# Altium project PCB_3U_Kasli.PrjPCB (part 5 of 7)

## Sheet FPGA_I2C.SchDoc: =ProjectName
size 420 x 297 mm; Author: G.K.; CompanyName: WUT; DrawnBy: P.K.; Organization: WUT ISE; Address1: Warsaw Univeristy of Technology; Address2: Nowowiejska 15/19; DocumentNumber: 11; Revision: 1.1; SheetNumber: 11; SheetTotal: 12; EDA_Number: ARTIQ; Projet: ARTIQ/SINARA; ModifiedBy: -; CreateDate: XX/XX/XXXX; CheckedDate: -; Title2: FPGA_I2C.SchDoc; DivGrp: ISE; Designer: P.K.; ModifiedDate: -; ProjectName: ARTIQ/SINARA
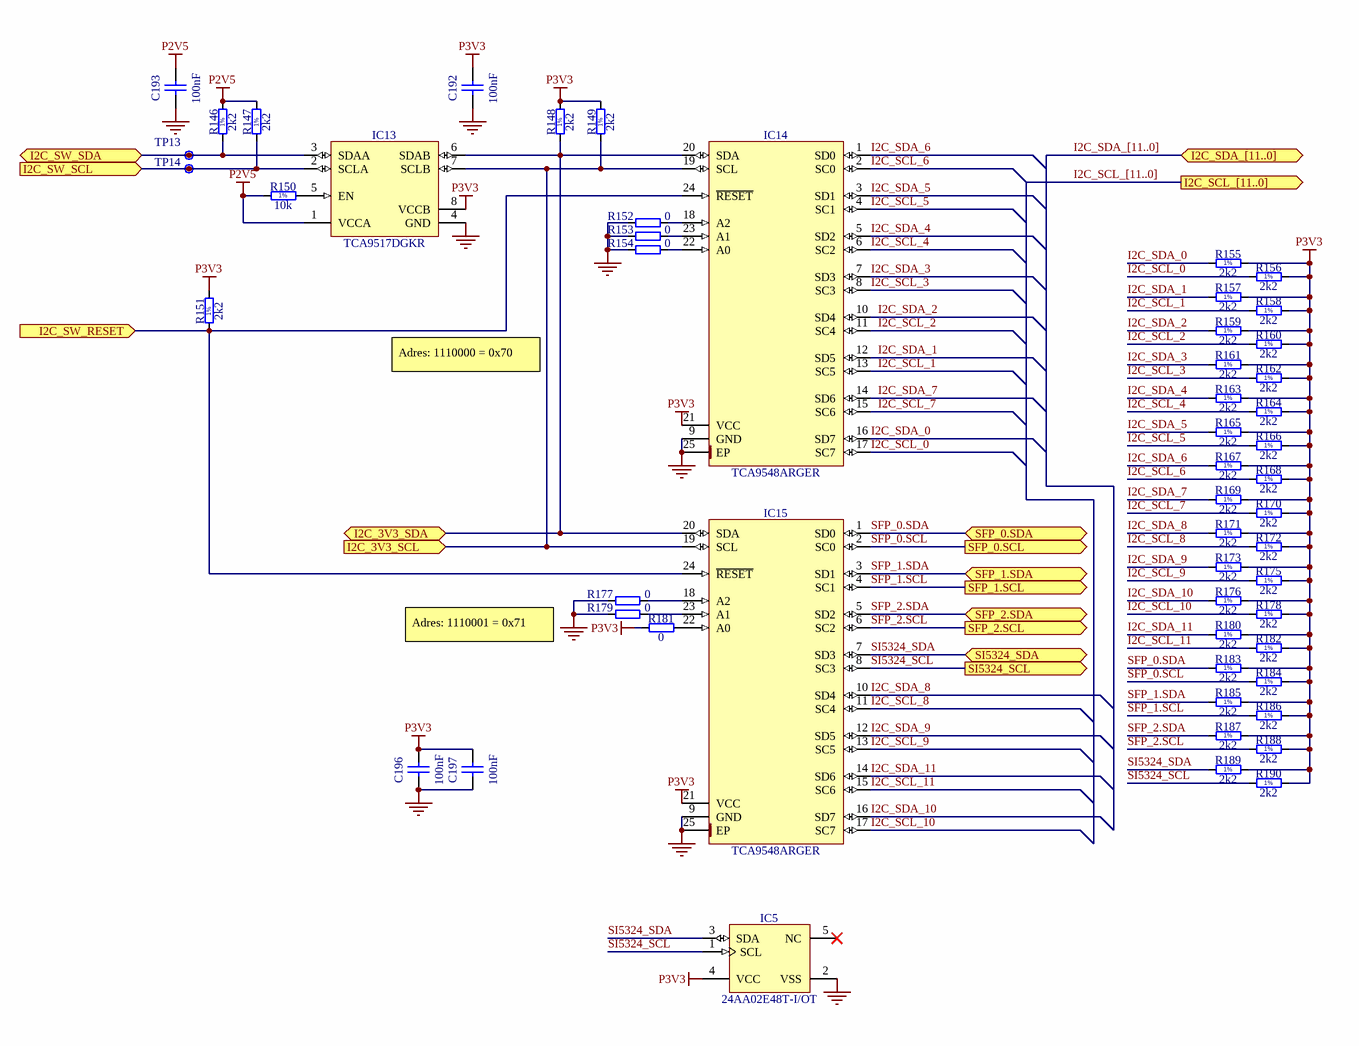
[diagram p8: FPGA_I2C.SchDoc]

### Parts
C192  100nF  [CAPC0603X33N]
C193  100nF  [CAPC0603X33N]
C196  100nF  [CAPC0603X33N]
C197  100nF  [CAPC0603X33N]
IC5  24AA02E48T-I/OT  [SOT95P280X145-5N]
IC13  TCA9517DGKR  [SOP65P490X110-8N]
IC14  TCA9548ARGER  [QFN50P400X400X100-25N-S220]
IC15  TCA9548ARGER  [QFN50P400X400X100-25N-S220]
R146  2k2  [RESC1005X40N]
R147  2k2  [RESC1005X40N]
R148  2k2  [RESC1005X40N]
R149  2k2  [RESC1005X40N]
R150  10k  [RESC1005X40N]
R151  2k2  [RESC1005X40N]
R152  0  [RESC1005X40N]
R153  0  [RESC1005X40N]
R154  0  [RESC1005X40N]
R155  2k2  [RESC1005X40N]
R156  2k2  [RESC1005X40N]
R157  2k2  [RESC1005X40N]
R158  2k2  [RESC1005X40N]
R159  2k2  [RESC1005X40N]
R160  2k2  [RESC1005X40N]
R161  2k2  [RESC1005X40N]
R162  2k2  [RESC1005X40N]
R163  2k2  [RESC1005X40N]
R164  2k2  [RESC1005X40N]
R165  2k2  [RESC1005X40N]
R166  2k2  [RESC1005X40N]
R167  2k2  [RESC1005X40N]
R168  2k2  [RESC1005X40N]
R169  2k2  [RESC1005X40N]
R170  2k2  [RESC1005X40N]
R171  2k2  [RESC1005X40N]
R172  2k2  [RESC1005X40N]
R173  2k2  [RESC1005X40N]
R175  2k2  [RESC1005X40N]
R176  2k2  [RESC1005X40N]
R177  0  [RESC1005X40N]
R178  2k2  [RESC1005X40N]
R179  0  [RESC1005X40N]
R180  2k2  [RESC1005X40N]
R181  0  [RESC1005X40N]
R182  2k2  [RESC1005X40N]
R183  2k2  [RESC1005X40N]
R184  2k2  [RESC1005X40N]
R185  2k2  [RESC1005X40N]
R186  2k2  [RESC1005X40N]
R187  2k2  [RESC1005X40N]
R188  2k2  [RESC1005X40N]
R189  2k2  [RESC1005X40N]
R190  2k2  [RESC1005X40N]
TP13  I2C SW SDA  [TPS127]  (value not drawn)
TP14  I2C SW SCL  [TPS127]  (value not drawn)

### Ports
I2C_3V3_SCL (in), I2C_3V3_SDA (bidir), I2C_SCL_[11..0] (out), I2C_SDA_[11..0] (bidir), I2C_SW_RESET (in), I2C_SW_SCL (in), I2C_SW_SDA (bidir), SFP_0.SCL (out), SFP_0.SDA (bidir), SFP_1.SCL (out), SFP_1.SDA (bidir), SFP_2.SCL (out), SFP_2.SDA (bidir), SI5324_SCL (out), SI5324_SDA (bidir)

### Nets
GND: C192.1 C193.1 C196.1 C197.1 IC5.2(VSS) IC13.4(GND) IC14.9(GND) IC14.25(EP) IC15.9(GND) IC15.25(EP) R152.1 R153.1 R154.1 R177.1 R179.1
P2V5: C193.2 IC13.1(VCCA) R146.2 R147.2 R150.1
P3V3: C192.2 C196.2 C197.2 IC5.4(VCC) IC13.8(VCCB) IC14.21(VCC) IC15.21(VCC) R148.2 R149.2 R151.2 R155.2 R156.2 R157.2 R158.2 R159.2 R160.2 R161.2 R162.2 R163.2 R164.2 R165.2 R166.2 R167.2 R168.2 R169.2 R170.2 R171.2 R172.2 R173.2 R175.2 R176.2 R178.2 R180.2 R181.1 R182.2 R183.2 R184.2 R185.2 R186.2 R187.2 R188.2 R189.2 R190.2
I2C_3V3_SCL: IC13.7(SCLB) IC14.19(SCL) IC15.19(SCL) R149.1 ; port I2C_3V3_SCL
I2C_3V3_SDA: IC13.6(SDAB) IC14.20(SDA) IC15.20(SDA) R148.1 ; port I2C_3V3_SDA
I2C_SCL_0: IC14.17(SC7) R156.1
I2C_SCL_1: IC14.13(SC5) R158.1
I2C_SCL_2: IC14.11(SC4) R160.1
I2C_SCL_3: IC14.8(SC3) R162.1
I2C_SCL_4: IC14.6(SC2) R164.1
I2C_SCL_5: IC14.4(SC1) R166.1
I2C_SCL_6: IC14.2(SC0) R168.1
I2C_SCL_7: IC14.15(SC6) R170.1
I2C_SCL_8: IC15.11(SC4) R172.1
I2C_SCL_9: IC15.13(SC5) R175.1
I2C_SCL_10: IC15.17(SC7) R178.1
I2C_SCL_11: IC15.15(SC6) R182.1
I2C_SDA_0: IC14.16(SD7) R155.1
I2C_SDA_1: IC14.12(SD5) R157.1
I2C_SDA_2: IC14.10(SD4) R159.1
I2C_SDA_3: IC14.7(SD3) R161.1
I2C_SDA_4: IC14.5(SD2) R163.1
I2C_SDA_5: IC14.3(SD1) R165.1
I2C_SDA_6: IC14.1(SD0) R167.1
I2C_SDA_7: IC14.14(SD6) R169.1
I2C_SDA_8: IC15.10(SD4) R171.1
I2C_SDA_9: IC15.12(SD5) R173.1
I2C_SDA_10: IC15.16(SD7) R176.1
I2C_SDA_11: IC15.14(SD6) R180.1
I2C_SW_RESET: IC14.24(~{RESET}) IC15.24(~{RESET}) R151.1 ; port I2C_SW_RESET
I2C_SW_SCL: IC13.2(SCLA) R147.1 TP14.1 ; port I2C_SW_SCL
I2C_SW_SDA: IC13.3(SDAA) R146.1 TP13.1 ; port I2C_SW_SDA
SFP_0.SCL: IC15.2(SC0) R184.1 ; port SFP_0.SCL
SFP_0.SDA: IC15.1(SD0) R183.1 ; port SFP_0.SDA
SFP_1.SCL: IC15.4(SC1) R186.1 ; port SFP_1.SCL
SFP_1.SDA: IC15.3(SD1) R185.1 ; port SFP_1.SDA
SFP_2.SCL: IC15.6(SC2) R188.1 ; port SFP_2.SCL
SFP_2.SDA: IC15.5(SD2) R187.1 ; port SFP_2.SDA
Si5324_SCL: IC5.1(SCL) IC15.8(SC3) R190.1 ; port SI5324_SCL
Si5324_SDA: IC5.3(SDA) IC15.7(SD3) R189.1 ; port SI5324_SDA
NetIC13_5: IC13.5(EN) R150.2
NetIC14_18: IC14.18(A2) R152.2
NetIC14_22: IC14.22(A0) R154.2
NetIC14_23: IC14.23(A1) R153.2
NetIC15_18: IC15.18(A2) R177.2
NetIC15_22: IC15.22(A0) R181.2
NetIC15_23: IC15.23(A1) R179.2

Not connected (* = marked no-connect by the designer): IC5 5(NC)*

### Buses and harness runs
bus I2C_SCL_[11..0] = port I2C_SCL_[11..0]
bus I2C_SDA_[11..0] = port I2C_SDA_[11..0]

### Notes on the sheet
- Adres: 1110000 = 0x70
- Adres: 1110001 = 0x71
- Project/Equipment
- Document
- Designer
- Drawn by
- Check.by
- File
- Last Mod.
- Print Date
- Sheet
- Size
- A3
- of
- Rev
- (in symbol R0402_2K2_1%_0.0625W_100PPM) 1%
- (in symbol R0402_10K_1%_0.0625W_100PPM) 1%

### Library data of the parts
C192 C193 C196 C197 = CC0201_100NF_6.3V_10%_X5R: as C134 on sheet PowerSupplies; Part Number: CC0201_100NF_6.3V_10%_X5R; Component Kind: Standard; Component Type: Standard; Pin Count: 2; Value: 100nF; Status: Not Recommended; Manufacturer Part Number: CC0201_100NF_6.3V_10%_X5R; Case: 0201; Mounted: Yes; Socket: No; SMD: Yes; Sense: No; Manufacturer1 Example: AVX; Manufacturer1 ComponentHeight: 0.33mm; HelpURL: \\cern.ch\dfs\Applications\Altium\Datasheets\CC0201_X5R_AVX.pdf; Author: CERN DEM JLC; CreateDate: 2007-12-03; LatestRevisionDate: 2007-12-03
IC5 = 24AA02E48T-I/OT: 1.7V-5.5V, 2K I2C Serial EEPROM With EUI-48 Node Identity; Manufacturer: MICROCHIP TECHNOLOGY; PressFit: No; Bonding: No; Part Number: 24AA02E48T-I/OT; Component Kind: Standard; Component Type: Standard; Device: 24AA02E48T-I/OT; PackageDescription: SOT, 0.95mm pitch; 5 pin, 1.60mm W X 2.90mm L X 1.45mm H body, IPC Medium Density; Part Description: 1.7V-5.5V, 2K I2C Serial EEPROM With EUI-48 Node Identity; Manufacturer Part Number: 24AA02E48T-I/OT; Pin Count: 5; Case: SOT23-5; Mounted: Yes; Socket: No; SMD: Yes; Sense: No; ComponentHeight: 1.45mm; HelpURL: \\cern.ch\dfs\Applications\Altium\Datasheets\24AA02E48T-I-OT.pdf; Author: CERN DEM MR; CreateDate: 2016-03-31; LatestRevisionDate: 2016-03-31
IC13 = TCA9517DGKR: Level-Translating I2C Bus Repeater; Manufacturer: TEXAS INSTRUMENTS; PressFit: No; Bonding: No; Part Number: TCA9517DGKR; Component Kind: Standard; Component Type: Standard; Device: TCA9517DGKR; PackageDescription: SOP, 0.65mm, Pitch; 8 Pin, 3.0mm W X 3.0mm L X 1.10mm H Body, IPC Medium Density; Part Description: Level-Translating I2C Bus Repeater; Manufacturer Part Number: TCA9517DGKR; Pin Count: 8; Case: TSSOP8; Mounted: Yes; Socket: No; SMD: Yes; Sense: No; ComponentHeight: 1.1mm; Author: CERN DEM JLC; HelpURL: \\cern.ch\dfs\Applications\Altium\Datasheets\TCA9517DGKR.pdf; CreateDate: 07.07.2014; LatestRevisionDate: 07.07.2014
IC14 IC15 = TCA9548ARGER: Low Voltage 8-Channel I2C Switch With Reset; Manufacturer: TEXAS INSTRUMENTS; PressFit: No; Bonding: No; Part Number: TCA9548ARGER; Component Kind: Standard; Component Type: Standard; Device: TCA9548ARGER; PackageDescription: QFN, 0.50mm Pitch, Square; 24 Pin, 4.00mm L X 4.00mm W X 1.00mm H body (w/thermal tab 2.2 X 2.2mm), IPC Medium Density; Part Description: Low Voltage 8-Channel I2C Switch With Reset; Manufacturer Part Number: TCA9548ARGER; Pin Count: 25; Case: QFN24; Mounted: Yes; Socket: No; SMD: Yes; Sense: No; ComponentHeight: 1mm; Author: CERN DEM JLC; HelpURL: \\cern.ch\dfs\Applications\Altium\Datasheets\TCA9548ARGER.pdf; CreateDate: 07.07.2014; LatestRevisionDate: 07.07.2014
R146-R149 R151 R155-R173 R175 R176 R178 R180 R182-R190 = R0402_2K2_1%_0.0625W_100PPM: Resistor - 1%; Part Description: General Purpose Thick Film Chip Resistor; Manufacturer: GENERIC; Manufacturer1 Part Number: 232270672202L; TC: ±100ppm/°C; PressFit: No; Part Number: R0402_2K2_1%_0.0625W_100PPM; Component Kind: Standard; Component Type: Standard; Pin Count: 2; Value: 2k2; Status: Not Recommended; Power: 0.0625W; Tolerance: ±1%; Manufacturer Part Number: R0402_2K2_1%_0.0625W_100PPM; Case: 0402; Mounted: Yes; Sense: No; Socket: No; SMD: Yes; Manufacturer1 Example: YAGEO PHYCOMP; Manufacturer1 ComponentHeight: 0.4mm; HelpURL: \\cern.ch\dfs\Applications\Altium\Datasheets\R0402_Phycomp_RC0402.pdf; Author: CERN DEM JLC; CreateDate: 03.12.2007; LatestRevisionDate: 17.10.2012
R150 = R0402_10K_1%_0.0625W_100PPM: as R51 on sheet PowerSupplies; Part Number: R0402_10K_1%_0.0625W_100PPM; Component Kind: Standard; Component Type: Standard; Pin Count: 2; Value: 10k; Status: Not Recommended; Power: 0.0625W; Tolerance: ±1%; Manufacturer Part Number: R0402_10K_1%_0.0625W_100PPM; Case: 0402; Mounted: Yes; Sense: No; Socket: No; SMD: Yes; Manufacturer1 Example: YAGEO PHYCOMP; Manufacturer1 ComponentHeight: 0.4mm; HelpURL: \\cern.ch\dfs\Applications\Altium\Datasheets\R0402_Phycomp_RC0402.pdf; Author: CERN DEM JLC; CreateDate: 03.12.2007; LatestRevisionDate: 17.10.2012
R152-R154 R177 R179 R181 = R0402_0R_JUMPER: as R46-R48 on sheet FPGAPower&Misc; Part Number: R0402_0R_JUMPER; Component Kind: Standard; Component Type: Standard; Pin Count: 2; Value: 0; Status: Not Recommended; Manufacturer Part Number: R0402_0R_JUMPER; Case: 0402; Mounted: Yes; Sense: No; Socket: No; SMD: Yes; Manufacturer1 Example: YAGEO PHYCOMP; Manufacturer1 ComponentHeight: 0.4mm; HelpURL: \\cern.ch\dfs\Applications\Altium\Datasheets\R0402_Phycomp_RC0402.pdf; Author: CERN DEM JLC; CreateDate: 03.12.2007; LatestRevisionDate: 17.10.2012
TP13 TP14 = SMD_PAD_1.27X1.27MM: as TP5-TP12 on sheet PowerSupplies; Part Number: SMD_PAD_1.27X1.27MM; Component Kind: Standard (No BOM); Component Type: Standard (No BOM); Pin Count: 1; Family: Test Point; Socket: No; SMD: Yes; Sense: No; Status: None; ComponentHeight: 0mm; HelpURL: Undefined; Author: CERN DEM JLC; CreateDate: 12.01.2008; LatestRevisionDate: 12.01.2008; PackageDescription: 1.27mm x 1.27mm PCB Copper Area (SMD Test Point)